# Altium schematic sheet Tray2.SchDoc
size A4
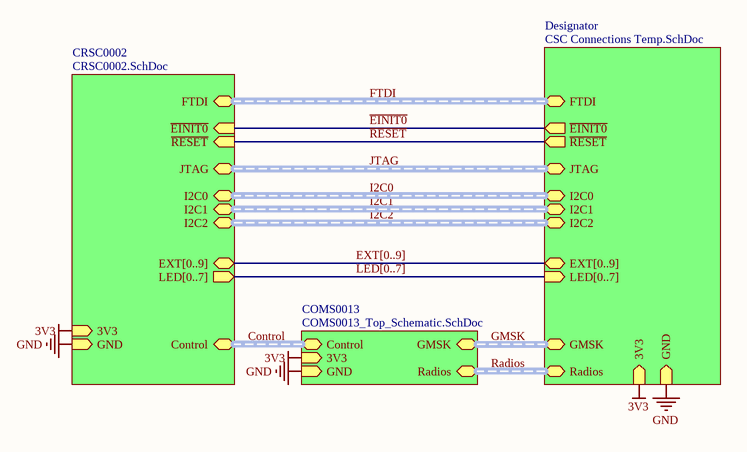
[diagram p0: Tray2.SchDoc]

## Sub-sheets
COMS0013 = COMS0013_Top_Schematic.SchDoc: GMSK (harness GMSK), Radios (harness Radios), Control (harness CommsControl), 3V3 (in), GND (in)
CRSC0002 = CRSC0002.SchDoc: ~{EINIT0} (in), ~{RESET} (in), I2C1 (harness I2C), I2C0 (harness I2C), I2C2 (harness I2C), JTAG (harness JTAG), Control (harness CommsControl), FTDI (harness FTDI), EXT[0..9] (bidir), LED[0..7] (out), 3V3 (in), GND (in)
Designator = CSC Connections Temp.SchDoc: JTAG (harness JTAG), FTDI (harness FTDI), I2C0 (harness I2C), I2C1 (harness I2C), I2C2 (harness I2C), GMSK (harness GMSK), Radios (harness Radios), ~{RESET} (out), ~{EINIT0} (out), LED[0..7] (in), EXT[0..9] (bidir), 3V3 (in), GND (in)

## Nets
3V3: sheet CRSC0002/3V3, sheet COMS0013/3V3, sheet Designator/3V3
GND: sheet CRSC0002/GND, sheet COMS0013/GND, sheet Designator/GND
~{EINIT0}: sheet CRSC0002/~{EINIT0}, sheet Designator/~{EINIT0}
~{RESET}: sheet CRSC0002/~{RESET}, sheet Designator/~{RESET}

## Buses and harness runs
bus EXT[0..9] = sheet CRSC0002/EXT[0..9] = sheet Designator/EXT[0..9]
bus LED[0..7] = sheet CRSC0002/LED[0..7] = sheet Designator/LED[0..7]
harness Control = sheet COMS0013/Control = sheet CRSC0002/Control
harness FTDI = sheet CRSC0002/FTDI = sheet Designator/FTDI
harness GMSK = sheet COMS0013/GMSK = sheet Designator/GMSK
harness I2C0 = sheet CRSC0002/I2C0 = sheet Designator/I2C0
harness I2C1 = sheet CRSC0002/I2C1 = sheet Designator/I2C1
harness I2C2 = sheet CRSC0002/I2C2 = sheet Designator/I2C2
harness JTAG = sheet CRSC0002/JTAG = sheet Designator/JTAG
harness Radios = sheet COMS0013/Radios = sheet Designator/Radios